# Altium schematic sheet Sedra.SchDoc
size A4
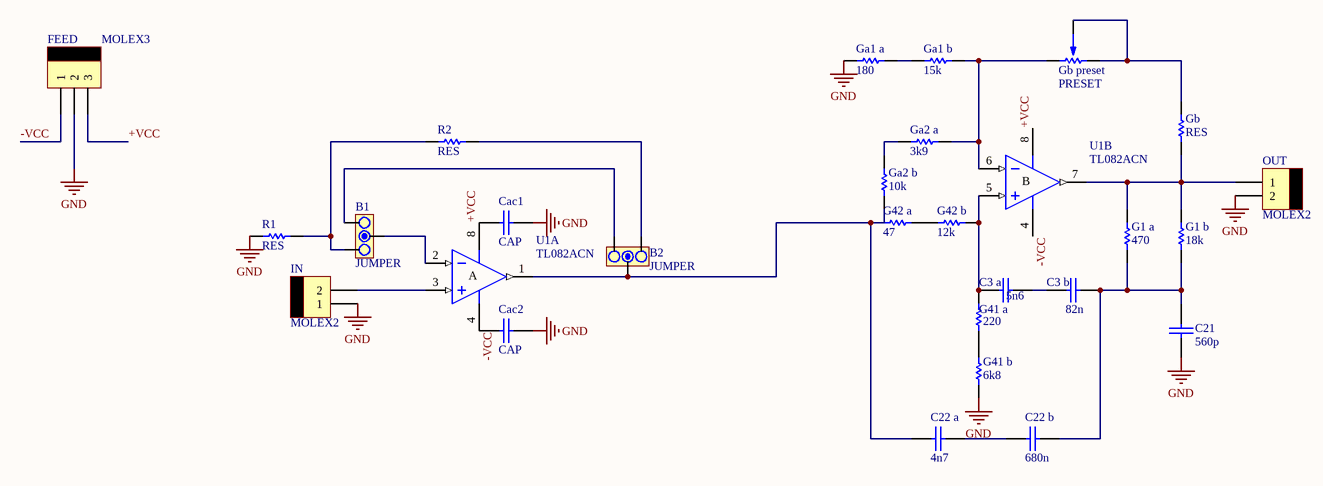
[diagram p0: Sedra.SchDoc]

## Parts
B1  JUMPER  [JUMPER3]
B2  JUMPER  [JUMPER3]
C3_a  5n6  [CAP200]
C3_b  82n  [CAP200]
C21  560p  [CAP200]
C22_a  4n7  [CAP200]
C22_b  680n  [CAP200]
Cac1  CAP  [CAP200]
Cac2  CAP  [CAP200]
FEED  MOLEX3  [MOLEX3]
G1_a  470  [0805]
G1_b  18k  [0805]
G41_a  220  [0805]
G41_b  6k8  [0805]
G42_a  47  [0805]
G42_b  12k  [0805]
Ga1_a  180  [0805]
Ga1_b  15k  [0805]
Ga2_a  3k9  [0805]
Ga2_b  10k  [0805]
Gb  RES  [0805]
Gb_preset  PRESET  [PRESET V]
IN  MOLEX2  [MOLEX2]
OUT  MOLEX2  [MOLEX2]
R1  RES  [0805]
R2  RES  [0805]
U1  TL082ACN  [DIP8]  (parts A,B of 2)

## Nets
GND: C21.2 Cac1.2 Cac2.2 FEED.2 G41_b.1 Ga1_a.1 IN.1 OUT.2 R1.1
+VCC: Cac1.1 FEED.3 U1.8(V+)
-VCC: Cac2.1 FEED.1 U1.4(V-)
NetB1_1: B1.1 R1.2 R2.1
NetB1_2: B1.2 U1.2(IN-)
NetB1_3: B1.3 B2.1
NetB2_2: B2.2 C22_a.1 G42_a.1 Ga2_b.1 U1.1(OUT)
NetB2_3: B2.3 R2.2
NetC3_a_1: C3_a.1 G41_a.2 G42_b.2 U1.5(IN+)
NetC3_a_2: C3_a.2 C3_b.1
NetC3_b_2: C3_b.2 C21.1 C22_b.2 G1_a.1 G1_b.1
NetC22_a_2: C22_a.2 C22_b.1
NetG1_a_2: G1_a.2 G1_b.2 Gb.1 OUT.1 U1.7(OUT)
NetG41_a_1: G41_a.1 G41_b.2
NetG42_a_2: G42_a.2 G42_b.1
NetGa1_a_2: Ga1_a.2 Ga1_b.1
NetGa1_b_2: Ga1_b.2 Ga2_a.2 Gb_preset.1 U1.6(IN-)
NetGa2_a_1: Ga2_a.1 Ga2_b.2
NetGb_2: Gb.2 Gb_preset.2 Gb_preset.3
NetIN_2: IN.2 U1.3(IN+)

## Notes on the sheet
- (in symbol TL082ACN, part A) A
- (in symbol TL082ACN, part B) B

## Library data of the parts
B1 B2 = JUMPER3
C3_a C3_b C21 C22_a C22_b = CAP
G1_a G1_b G41_a G41_b G42_a G42_b Ga1_a Ga1_b Ga2_a Ga2_b = RES
U1 = TL082ACN: General-Purpose J-FET Dual Operational Amplifier; Published: 24-Aug-2001; LatestRevisionDate: 06-Jun-2005; LatestRevisionNote: Stylized 3D Model Added.; DatasheetVersion: Jan-1999; PackageReference: DIP8; Publisher: Altium Limited; PackageDescription: DIP; 8 Leads; Row Spacing 7.62 mm; Pitch 2.54 mm; Code_JEDEC: MO-001-AN; ComponentLink1Description: Manufacturer Link; ComponentLink1URL: http://www.st.com/; ComponentLink2Description: Datasheet; ComponentLink2URL: http://www.st.com/stonline/products/literature/ds/2300/tl082.pdf